# EAGLE design DUAL CHANNEL REAY DRIVER (EAGLE 6.5.0)
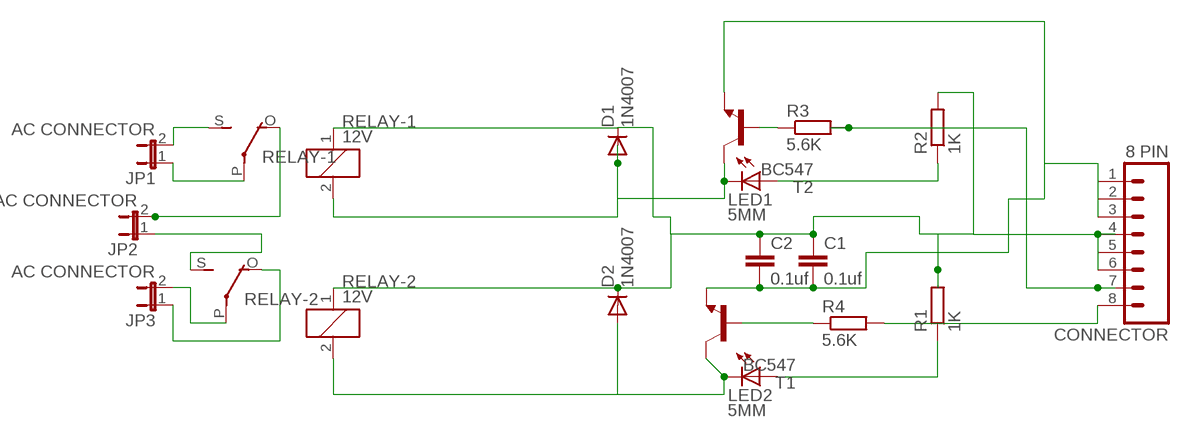
[diagram p0: schematic, sheet 1]

## Parts
C1  0.1uf  C2,5-3  [C2.5-3]
C2  0.1uf  C2,5-3  [C2.5-3]
CONNECTOR  8 PIN  M08  [08P]
D1  1N4007  1N4004  [DO41-10]
D2  1N4007  1N4004  [DO41-10]
JP1  AC CONNECTOR  JP1E  [JP1]
JP2  AC CONNECTOR  JP1E  [JP1]
JP3  AC CONNECTOR  JP1E  [JP1]
LED1  5MM  LED5MM  [LED5MM]
LED2  5MM  LED5MM  [LED5MM]
R1  1K  R-EU_0204/7  [0204/7]
R2  1K  R-EU_0204/7  [0204/7]
R3  5.6K  R-EU_0204/7  [0204/7]
R4  5.6K  R-EU_0204/7  [0204/7]
RELAY-1  12V  G5L  [G5LE]
RELAY-2  12V  G5L  [G5LE]
T1  BC547  [TO92]
T2  BC547  [TO92]

## Nets
N$1: D1.A LED1.K(C) RELAY-1.2 T2.3(C)
N$2: C1.1 C2.1 CONNECTOR.4 CONNECTOR.5 CONNECTOR.6 D1.C D2.C R1.2 R2.2 RELAY-1.1 RELAY-2.1
N$5: R4.1 T1.2(B)
N$6: R3.1 T2.2(B)
N$7: LED1.A R2.1
N$8: LED2.A R1.1
N$9: JP1.2 RELAY-1.S(2:S)
N$10: JP1.1 RELAY-1.P(2:P)
N$11: JP2.2 RELAY-1.O(2:O)
N$12: JP2.1 RELAY-2.S(2:S)
N$13: JP3.2 RELAY-2.P(2:P)
N$14: JP3.1 RELAY-2.O(2:O)
N$16: C1.2 C2.2 CONNECTOR.1 CONNECTOR.2 CONNECTOR.3 T1.1(E) T2.1(E)
N$17: CONNECTOR.7 R3.2
N$18: CONNECTOR.8 R4.2
N$20: D2.A LED2.K(C) RELAY-2.2 T1.3(C)

## Library data of the parts
C1 C2 = capacitor-wima:C: CAPACITOR naming: grid - package width
CONNECTOR = con-amp-quick:M08: AMP QUICK CONNECTOR; OC_FARNELL: unknown; OC_NEWARK: unknown
D1 D2 = diode:1N4004: DIODE general purpose rectifier, 1 A
JP1-JP3 = jumper:JP1E: JUMPER
LED1 LED2 = led:LED: LED OSRAM: - CHIPLED LG R971, LG N971, LY N971, LG Q971, LY Q971, LO R971, LY R971 LH N974, LH R974 LS Q976, LO Q976, LY Q976 LO Q996 - Hyper CHIPLED LW Q18S LB Q993, LB Q99A, LB R99A - SideLED LS A670, LO A670, LY A670, LG A670, LP A670 LB A673, LV A673, LT A673, LW A673 LH A674 LY A675 LS A676, LA A676, LO A676, LY A676, LW A676 LS A679, LY A679, LG A679 - Hyper Micro SIDELED® LS Y876, LA Y876, LO Y876, LY Y876 LT Y87S - SmartLED LW L88C, LW L88S LB L89C, LB L89S, LG L890 LS L89K, LO L89K, LY L89K LS L896, LA L896, LO L896, LY L896 - TOPLED LS T670, LO T670, LY T670, LG T670, LP T670 LSG T670, LSP T670, LSY T670, LOP T670, LYG T670 LG T671, LOG T671, LSG T671 LB T673, LV T673, LT T673, LW T673 LH T674 LS T676, LA T676, LO T676, LY T676, LB T676, LH T676, LSB T676, LW T676 LB T67C, LV T67C, LT T67C, LS T67K, LO T67K, LY T67K, LW E67C LS E67B, LA E67B, LO E67B, LY E67B, LB E67C, LV E67C, LT E67C LW T67C LS T679, LY T679, LG T679 LS T770, LO T770, LY T770, LG T770, LP T770 LB T773, LV T773, LT T773, LW T773 LH T774 LS E675, LA E675, LY E675, LS T675 LS T776, LA T776, LO T776, LY T776, LB T776 LHGB T686 LT T68C, LB T68C - Hyper Mini TOPLED® LB M676 - Mini TOPLED Santana® LG M470 LS M47K, LO M47K, LY M47K Source: http://www.osram.convergy.de LUXEON: - LUMILED® LXK2-PW12-R00, LXK2-PW12-S00, LXK2-PW14-U00, LXK2-PW14-V00 LXK2-PM12-R00, LXK2-PM12-S00, LXK2-PM14-U00 LXK2-PE12-Q00, LXK2-PE12-R00, LXK2-PE12-S00, LXK2-PE14-T00, LXK2-PE14-U00 LXK2-PB12-K00, LXK2-PB12-L00, LXK2-PB12-M00, LXK2-PB14-N00, LXK2-PB14-P00, LXK2-PB14-Q00 LXK2-PR12-L00, LXK2-PR12-M00, LXK2-PR14-Q00, LXK2-PR14-R00 LXK2-PD12-Q00, LXK2-PD12-R00, LXK2-PD12-S00 LXK2-PH12-R00, LXK2-PH12-S00 LXK2-PL12-P00, LXK2-PL12-Q00, LXK2-PL12-R00 Source: www.luxeon.com KINGBRIGHT: KA-3528ASYC Source: www.kingbright.com
R1-R4 = rcl:R-EU_: RESISTOR, European symbol
RELAY-1 RELAY-2 = relay:G5L: RELAY 1 x switch, 10 A/120 V AC, 8 A/30 V ADC, Omron; OC_FARNELL: unknown; OC_NEWARK: unknown
T1 T2 = transistor:BC547: NPN TRANSISTOR

## Board
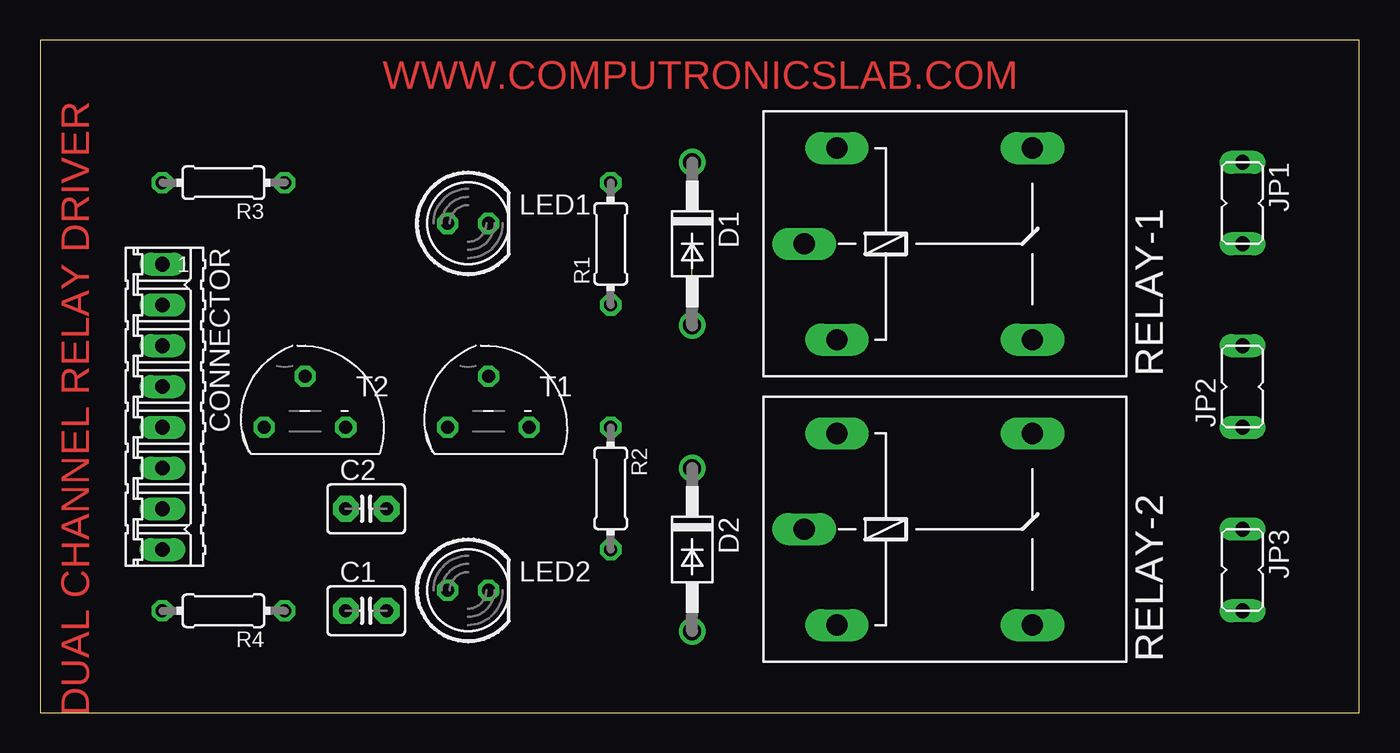
[diagram p1: board, top side]
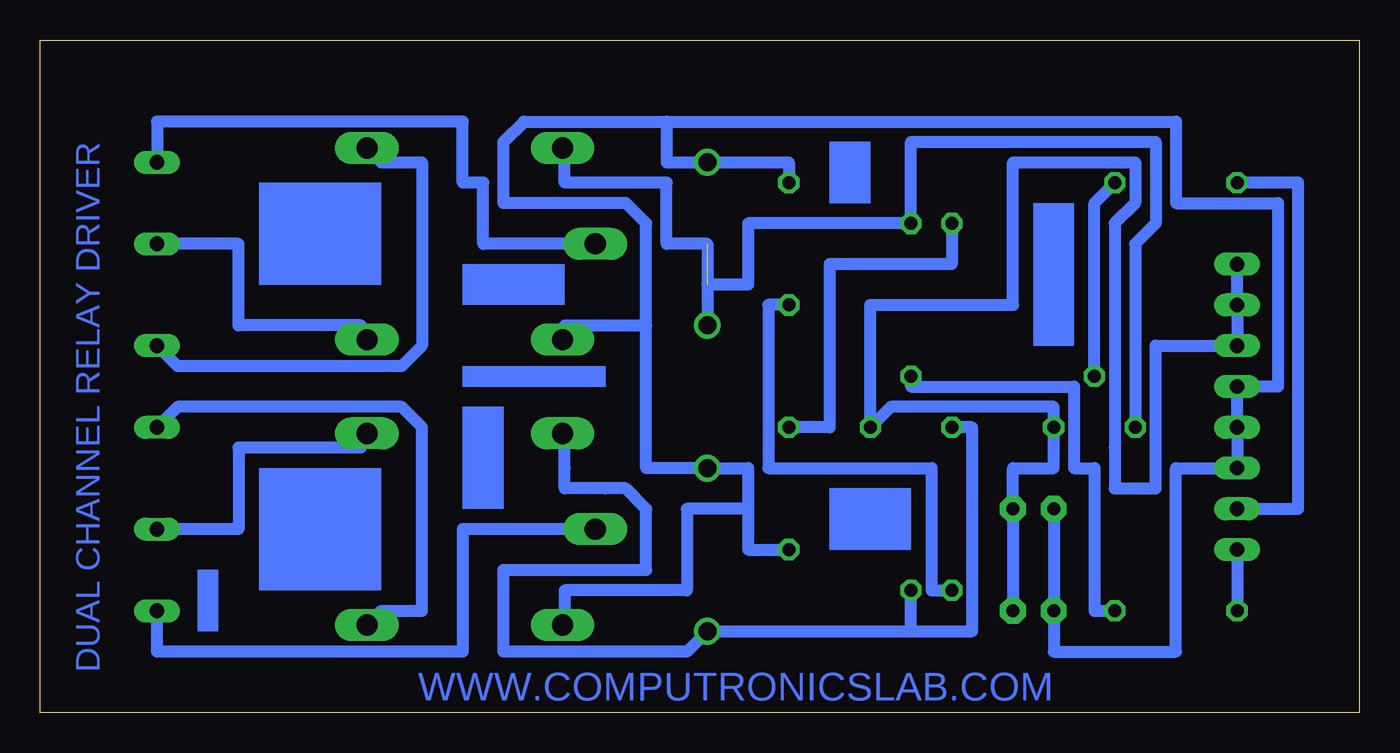
[diagram p2: board, bottom side, seen from below]

Size 82.22 x 41.9 mm. Coordinates in mm from the lower left corner, seen from the top.
Outline: 0,0 82.22,0 82.22,41.9 0,41.9 0,0
Copper layers (1*16): Top 0.035mm / dielectric 1.5mm / Bottom 0.035mm
Design rules "default *": minimum track width 30mil, minimum drill 24mil, track to track 8mil, track to pad 8mil, pad to pad 8mil, via to via 8mil, smd to smd 8mil, copper to edge 40mil, drill to drill 8mil, minimum pad ring 10mil, minimum via ring 8mil, stop-mask expansion 4mil, vias tented up to drill 0mil, thermal gap 10mil

### Footprints (pad centres in the part's own frame; a part is rotated, then mirrored left to right if it is on the bottom)
C2.5-3 = drill 0.813 pad 1.6 octagon: 1 -1.27,0; 2 1.27,0
08P = drill 0.914 long: 1 -8.89,0; 2 -6.35,0; 3 -3.81,0; 4 -1.27,0; 5 1.27,0; 6 3.81,0; 7 6.35,0; 8 8.89,0
DO41-10 = drill 1.118: A 5.08,0; C -5.08,0
JP1 = drill 0.914 long: 1 0,-2.54; 2 0,2.54
LED5MM = drill 0.813 octagon: A -1.27,0; K 1.27,0
0204/7 = drill 0.813 octagon: 1 -3.81,0; 2 3.81,0
G5LE = drill 1.321 long: 1 -7.493,-5.969; 2 -7.493,5.969; O 4.699,5.969; P -9.525,0; S 4.699,-5.969
TO92 = drill 0.813 octagon: 1 2.54,-1.27; 2 0,1.905; 3 -2.54,-1.27

### Placement (x,y rotation side)
C1  20.32,6.35 0 top
C2  20.32,12.7 0 top
CONNECTOR  7.62,19.05 270 top
D1  40.64,29.21 270 top
D2  40.64,10.16 270 top
JP1  74.93,31.75 180 top
JP2  74.93,20.32 0 top
JP3  74.93,8.89 180 top
LED1  26.67,30.48 0 top
LED2  26.67,7.62 0 top
R1  35.56,29.21 90 top
R2  35.56,13.97 270 top
R3  11.43,33.02 180 top
R4  11.43,6.35 180 top
RELAY-1  57.15,29.21 0 top
RELAY-2  57.15,11.43 0 top
T1  27.94,19.05 0 top
T2  16.51,19.05 0 top

### Tracks (layer width: path | path; a pad name or v marks a point on that pad's centre or on a via)
N$1  (1 unrouted)
  Bottom 0.762: T2.3 13.97,29.21 12.7,30.48 12.7,35.56 27.94,35.56 LED1.K 38.1,30.48 38.1,26.67 40.64,26.67 | D1.A 40.64,29.21 43.18,29.21 43.18,33.02 49.53,33.02 49.53,34.29 RELAY-1.2
N$2
  Bottom 0.762: C2.1 C1.1 19.05,3.81 11.43,3.81 11.43,15.24 CONNECTOR.6 CONNECTOR.5 CONNECTOR.4 5.08,20.32 5.08,31.75 11.43,31.75 11.43,36.83 43.18,36.83 | R1.2 35.56,34.29 D1.C 43.18,34.29 43.18,36.83 | 38.1,12.7 38.1,15.24 D2.C 44.45,15.24 44.45,24.13 | 38.1,12.7 38.1,10.16 R2.2 | 38.1,12.7 41.91,12.7 41.91,7.62 49.53,7.62 49.53,6.35 RELAY-2.1 | 49.53,22.86 RELAY-1.1 49.53,24.13 44.45,24.13 | 43.18,36.83 52.07,36.83 53.34,35.56 53.34,31.75 45.72,31.75 44.45,30.48 44.45,24.13
N$5
  Bottom 0.762: R4.1 16.51,6.35 16.51,15.24 17.78,15.24 17.78,20.32 27.94,20.32 T1.2
N$6
  Bottom 0.762: R3.1 16.51,31.75 T2.2
N$7
  Bottom 0.762: R2.1 33.02,17.78 33.02,27.94 25.4,27.94 LED1.A
N$8
  Bottom 0.762: LED2.A 26.67,7.62 26.67,13.97 26.67,15.24 36.83,15.24 36.83,25.4 R1.1
N$9
  Bottom 0.762: JP1.2 69.85,29.21 69.85,24.13 62.23,24.13 RELAY-1.S
N$10
  Bottom 0.762: JP1.1 74.93,36.83 72.39,36.83 58.42,36.83 55.88,36.83 55.88,33.02 54.61,33.02 54.61,29.21 RELAY-1.P
N$11
  Bottom 0.762: JP2.2 73.66,21.59 59.69,21.59 58.42,22.86 58.42,34.29 60.96,34.29 RELAY-1.O
N$12
  Bottom 0.762: JP2.1 73.66,19.05 59.69,19.05 58.42,17.78 58.42,6.35 60.96,6.35 RELAY-2.S
N$13
  Bottom 0.762: JP3.2 74.93,3.81 55.88,3.81 55.88,11.43 RELAY-2.P
N$14
  Bottom 0.762: JP3.1 69.85,11.43 69.85,16.51 62.23,16.51 RELAY-2.O
N$16
  Bottom 0.762: CONNECTOR.1 CONNECTOR.2 CONNECTOR.3 8.89,22.86 12.7,22.86 12.7,19.05 12.7,16.51 12.7,15.24 12.7,13.97 15.24,13.97 15.24,16.51 15.24,30.48 13.97,31.75 13.97,34.29 21.59,34.29 21.59,25.4 30.48,25.4 T1.1 29.21,19.05 19.05,19.05 T2.1 19.05,15.24 21.59,15.24 C2.2 C1.2
N$17
  Bottom 0.762: R3.2 3.81,33.02 3.81,12.7 CONNECTOR.7
N$18
  Bottom 0.762: CONNECTOR.8 R4.2
N$20
  Bottom 0.762: T1.3 24.13,17.78 24.13,5.08 27.94,5.08 | 27.94,5.08 D2.A 41.91,3.81 53.34,3.81 53.34,5.08 53.34,8.89 49.53,8.89 44.45,8.89 44.45,12.7 45.72,13.97 46.99,13.97 49.53,13.97 49.53,15.24 49.53,16.51 RELAY-2.2 | 27.94,5.08 LED2.K
(copper drawn outside any net)
  shapes: Bottom area x9

### Text on the board
Top: WWW.COMPUTRONICSLAB.COM | DUAL CHANNEL RELAY DRIVER
Bottom: DUAL CHANNEL RELAY DRIVER | WWW.COMPUTRONICSLAB.COM